# Altium schematic sheet ABC2.SchDoc
size D
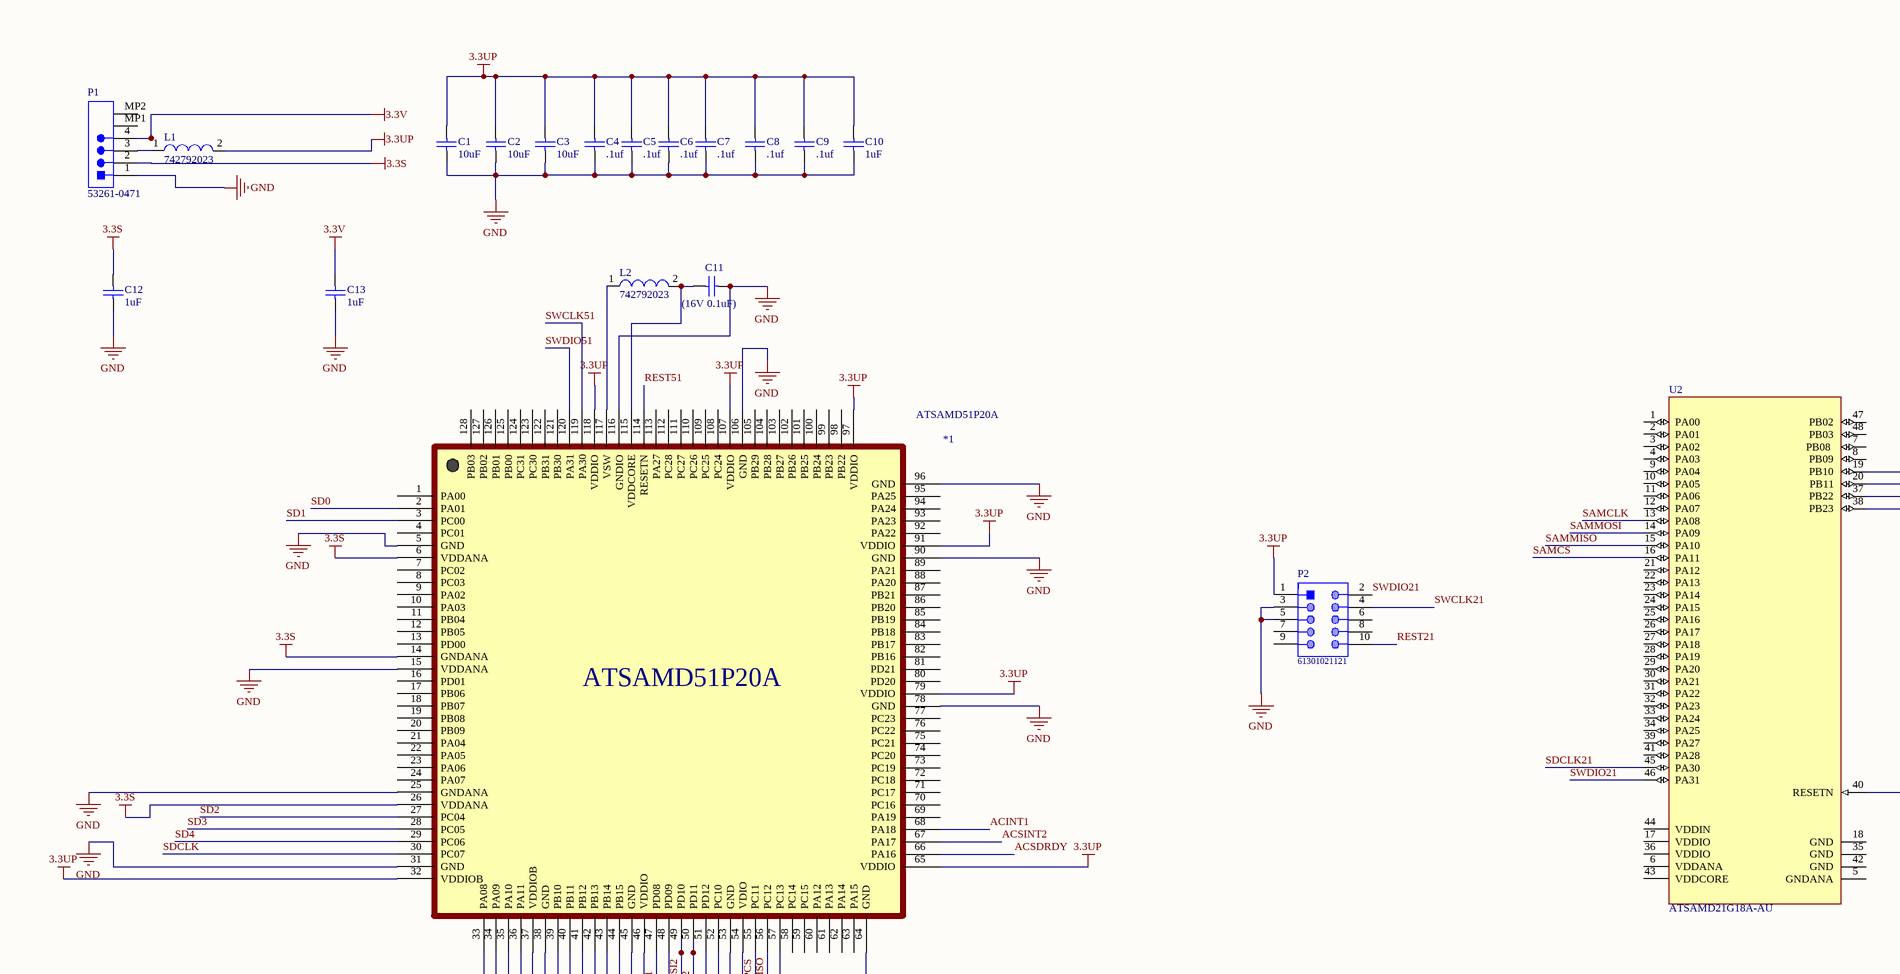
[diagram p0: ABC2.SchDoc, top left]
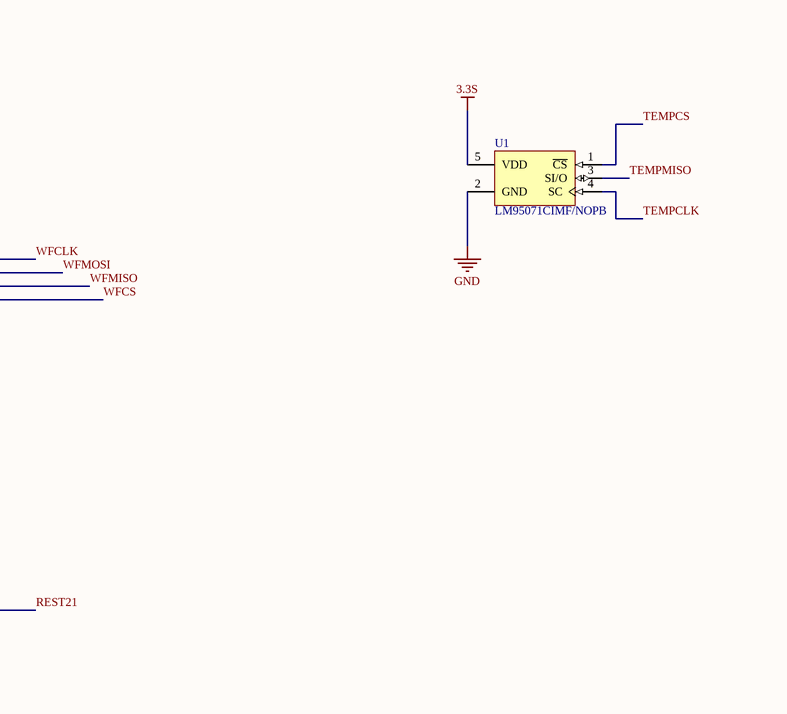
[diagram p1: ABC2.SchDoc, top right]
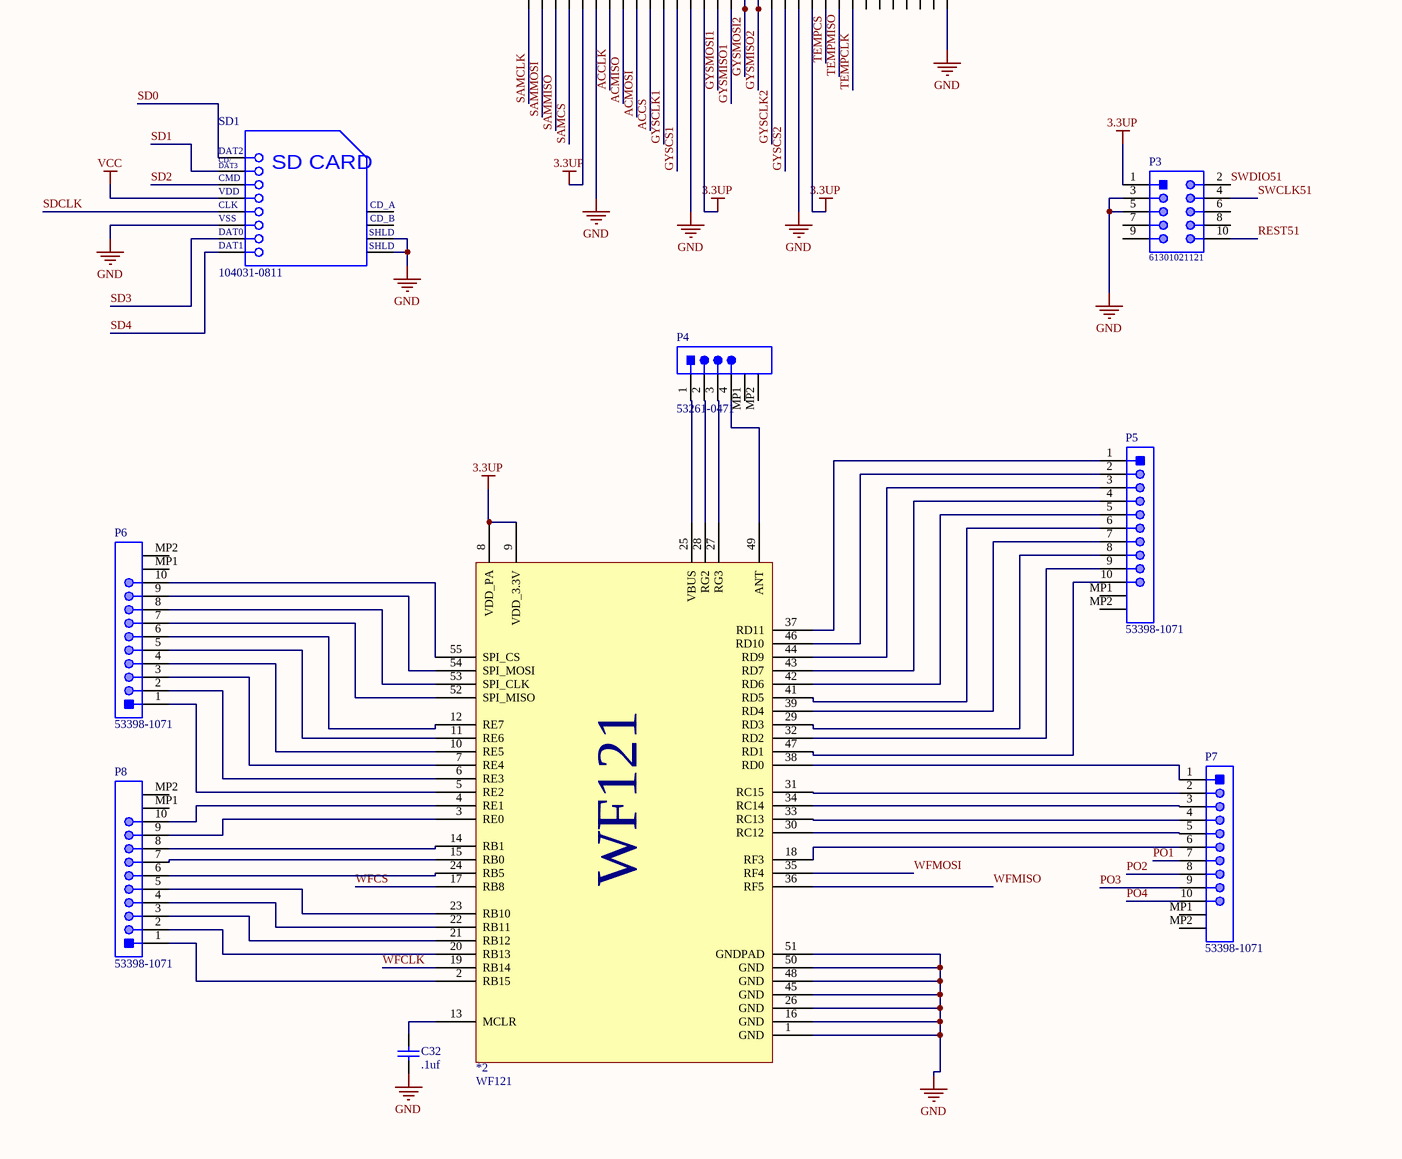
[diagram p2: ABC2.SchDoc, bottom left]
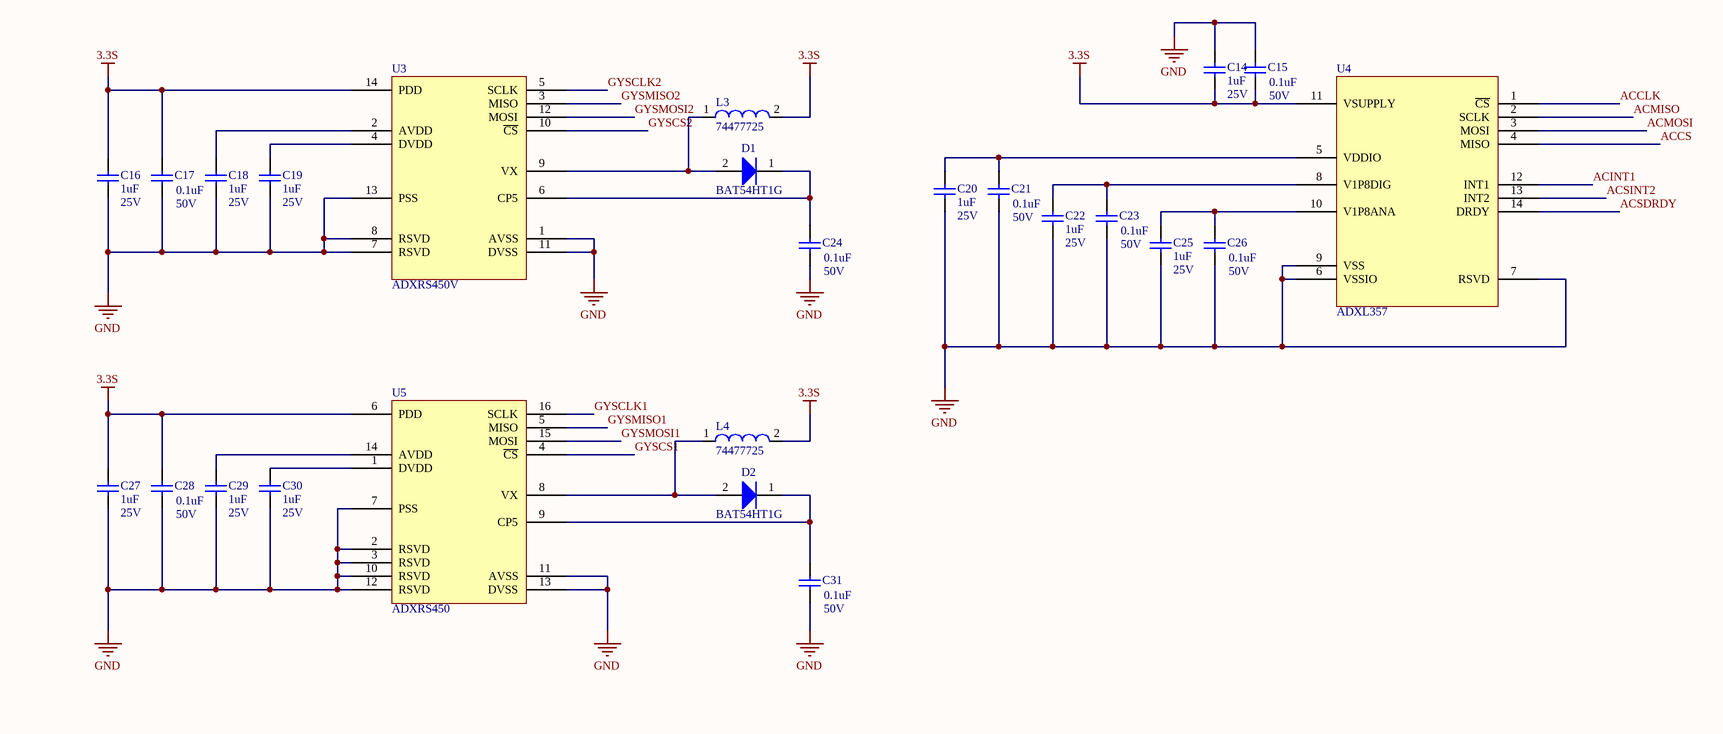
[diagram p3: ABC2.SchDoc, bottom right]

## Parts
*1  ATSAMD51P20A  [ATSAMD51P20A]
*2  WF121  [WF121]
C1  10uF  [CAPC1608X90X35NL10T15]
C2  10uF  [CAPC1608X90X35NL10T15]
C3  10uF  [CAPC1608X90X35NL10T15]
C4  .1uf  [CAPC2013X94X50NL20T25]
C5  .1uf  [CAPC2013X94X50NL20T25]
C6  .1uf  [CAPC2013X94X50NL20T25]
C7  .1uf  [CAPC2013X94X50NL20T25]
C8  .1uf  [CAPC2013X94X50NL20T25]
C9  .1uf  [CAPC2013X94X50NL20T25]
C10  1uF  [CAPC1608X90X35LL15T15]
C11  (16V 0.1uF)  [CAPC1608X90X35LL15T15]
C12  1uF  [CAPC1608X90X35LL15T15]
C13  1uF  [CAPC1608X90X35LL15T15]
C14  Capacitance: 1uF  Voltage Rating: 25V  [CAPC2013X140X50LL20T25]  (hidden comment: C0805C105K3RACTU)
C15  Voltage Rating: 50V  Capacitance: 0.1uF  [CAPC2013X95X50ML10T25]  (hidden comment: CC0805KRX7R9BB104)
C16  Capacitance: 1uF  Voltage Rating: 25V  [CAPC2013X140X50LL20T25]  (hidden comment: C0805C105K3RACTU)
C17  Voltage Rating: 50V  Capacitance: 0.1uF  [CAPC2013X95X50ML10T25]  (hidden comment: CC0805KRX7R9BB104)
C18  Capacitance: 1uF  Voltage Rating: 25V  [CAPC2013X140X50LL20T25]  (hidden comment: C0805C105K3RACTU)
C19  Capacitance: 1uF  Voltage Rating: 25V  [CAPC2013X140X50LL20T25]  (hidden comment: C0805C105K3RACTU)
C20  Capacitance: 1uF  Voltage Rating: 25V  [CAPC2013X140X50LL20T25]  (hidden comment: C0805C105K3RACTU)
C21  Voltage Rating: 50V  Capacitance: 0.1uF  [CAPC2013X95X50ML10T25]  (hidden comment: CC0805KRX7R9BB104)
C22  Capacitance: 1uF  Voltage Rating: 25V  [CAPC2013X140X50LL20T25]  (hidden comment: C0805C105K3RACTU)
C23  Voltage Rating: 50V  Capacitance: 0.1uF  [CAPC2013X95X50ML10T25]  (hidden comment: CC0805KRX7R9BB104)
C24  Voltage Rating: 50V  Capacitance: 0.1uF  [CAPC2013X95X50ML10T25]  (hidden comment: CC0805KRX7R9BB104)
C25  Capacitance: 1uF  Voltage Rating: 25V  [CAPC2013X140X50LL20T25]  (hidden comment: C0805C105K3RACTU)
C26  Voltage Rating: 50V  Capacitance: 0.1uF  [CAPC2013X95X50ML10T25]  (hidden comment: CC0805KRX7R9BB104)
C27  Capacitance: 1uF  Voltage Rating: 25V  [CAPC2013X140X50LL20T25]  (hidden comment: C0805C105K3RACTU)
C28  Voltage Rating: 50V  Capacitance: 0.1uF  [CAPC2013X95X50ML10T25]  (hidden comment: CC0805KRX7R9BB104)
C29  Capacitance: 1uF  Voltage Rating: 25V  [CAPC2013X140X50LL20T25]  (hidden comment: C0805C105K3RACTU)
C30  Capacitance: 1uF  Voltage Rating: 25V  [CAPC2013X140X50LL20T25]  (hidden comment: C0805C105K3RACTU)
C31  Voltage Rating: 50V  Capacitance: 0.1uF  [CAPC2013X95X50ML10T25]  (hidden comment: CC0805KRX7R9BB104)
C32  .1uf  [CAPC2013X94X50NL20T25]
D1  BAT54HT1G  [ONSC-SOD-323-2-477-02_V]
D2  BAT54HT1G  [ONSC-SOD-323-2-477-02_V]
L1  742792023  [SMD-0805]
L2  742792023  [SMD-0805]
L3  74477725  [WE-PD-M]
L4  74477725  [WE-PD-M]
P1  53261-0471  [MOLEX-53261-0471_V]
P2  61301021121  [61301021121]
P3  61301021121  [61301021121]
P4  53261-0471  [MOLEX-53261-0471_V]
P5  53398-1071  [MOLX-53398-1071_V]
P6  53398-1071  [MOLX-53398-1071_V]
P7  53398-1071  [MOLX-53398-1071_V]
P8  53398-1071  [MOLX-53398-1071_V]
SD1  104031-0811  [MOLX-104031-0811_V]
U1  LM95071CIMF/NOPB  [DBV0005A_L]
U2  ATSAMD21G18A-AU  [ATML-TQFP48_M]
U3  ADXRS450V  [LCC127P900X400X915-14N]
U4  ADXL357  [LCCS127P605X560X220-14N]
U5  ADXRS450  [SOIC127P1040X373-16N]

## Nets
3.3S: *1.6(VDDANA) *1.14(GNDANA) *1.26(VDDANA) C12.1 C14.2 C15.2 C16.1 C17.1 C27.1 C28.1 L3.2 L4.2 P1.2 U1.5(VDD) U3.14(PDD) U4.11(VSUPPLY) U5.6(PDD)
3.3UP: *1.32(VDDIOB) *1.37(VDDIOB) *1.46(VDDIO) *1.54(VDIO) *1.65(VDDIO) *1.79(VDDIO) *1.91(VDDIO) *1.97(VDDIO) *1.107(VDDIO) *1.118(VDDIO) *2.8(VDD_PA) *2.9(VDD_3.3V) C1.2 C2.2 C3.2 C4.2 C5.2 C6.2 C7.2 C8.2 C9.2 C10.2 L1.2 P2.1 P3.1
3.3V: C13.1 P1.4
GND: *1.5(GND) *1.15(VDDANA) *1.25(GNDANA) *1.31(GND) *1.38(GND) *1.45(GND) *1.53(GND) *1.64(GND) *1.78(GND) *1.90(GND) *1.96(GND) *1.106(GND) *1.116(GNDIO) *2.1(GND) *2.16(GND) *2.26(GND) *2.45(GND) *2.48(GND) *2.50(GND) *2.51(GNDPAD) C1.1 C2.1 C3.1 C4.1 C5.1 C6.1 C7.1 C8.1 C9.1 C10.1 C11.2 C12.2 C13.2 C14.1 C15.1 C16.2 C17.2 C18.2 C19.2 C20.2 C21.2 C22.2 C23.2 C24.2 C25.2 C26.2 C27.2 C28.2 C29.2 C30.2 C31.2 C32.1 P1.1 P2.3 P2.5 P3.3 P3.5 SD1.6(VSS2) SD1.11(SHLD1) SD1.12(SHLD2) U1.2(GND) U3.1(AVSS) U3.7(RSVD) U3.8(RSVD) U3.11(DVSS) U3.13(PSS) U4.6(VSSIO) U4.7(RSVD) U4.9(VSS) U5.2(RSVD) U5.3(RSVD) U5.7(PSS) U5.10(RSVD) U5.11(AVSS) U5.12(RSVD) U5.13(DVSS)
VCC: SD1.4(VDD)
ACCLK: *1.39(PB10) U4.1(~{CS})
ACCS: *1.42(PB13) U4.4(MISO)
ACINT1: *1.68(PA18) U4.12(INT1)
ACMISO: *1.40(PB11) U4.2(SCLK)
ACMOSI: *1.41(PB12) U4.3(MOSI)
ACSDRDY: *1.66(PA16) U4.14(DRDY)
ACSINT2: *1.67(PA17) U4.13(INT2)
GYSCLK1: *1.43(PB14) U5.16(SCLK)
GYSCLK2: *1.51(PD12) U3.5(SCLK)
GYSCS1: *1.44(PB15) U5.4(~{CS})
GYSCS2: *1.52(PC10) U3.10(~{CS})
GYSMISO1: *1.48(PD09) U5.5(MISO)
GYSMISO2: *1.50(PD11) U3.3(MISO)
GYSMOSI1: *1.47(PD08) U5.15(MOSI)
GYSMOSI2: *1.49(PD10) U3.12(MOSI)
PO1: P7.7
PO2: P7.8
PO3: P7.9
PO4: P7.10
REST21: P2.10 U2.40(RESETN)
REST51: *1.114(RESETN) P3.10
SAMCLK: *1.33(PA08) U2.13(PA08)
SAMCS: *1.36(PA11) U2.16(PA11)
SAMMISO: *1.35(PA10) U2.15(PA10)
SAMMOSI: *1.34(PA09) U2.14(PA09)
SD0: *1.2(PA01) SD1.1(CD/DAT3)
SD1: *1.3(PC00) SD1.2(CMD)
SD2: *1.27(PC04) SD1.3(VSS1)
SD3: *1.28(PC05) SD1.7(DAT0)
SD4: *1.29(PC06) SD1.8(DAT1)
SDCLK: *1.30(PC07) SD1.5(CLK)
SDCLK21: U2.45(PA30)
SWCLK21: P2.4
SWCLK51: *1.119(PA30) P3.4
SWDIO21: P2.2 U2.46(PA31)
SWDIO51: *1.120(PA31) P3.2
TEMPCLK: *1.57(PC13) U1.4(SC)
TEMPCS: *1.55(PC11) U1.1(~{CS})
TEMPMISO: *1.56(PC12) U1.3(SI/O)
WFCLK: *2.19(RB14) U2.19(PB10)
WFCS: *2.17(RB8) U2.38(PB23)
WFMISO: *2.36(RF5) U2.37(PB22)
WFMOSI: *2.35(RF4) U2.20(PB11)
Net*1_115: *1.115(VDDCORE) C11.1 L2.2
Net*1_117: *1.117(VSW) L2.1
Net*2_2: *2.2(RB15) P8.1
Net*2_3: *2.3(RE0) P8.9
Net*2_4: *2.4(RE1) P8.10
Net*2_5: *2.5(RE2) P6.1
Net*2_6: *2.6(RE3) P6.2
Net*2_7: *2.7(RE4) P6.3
Net*2_10: *2.10(RE5) P6.4
Net*2_11: *2.11(RE6) P6.5
Net*2_12: *2.12(RE7) P6.6
Net*2_13: *2.13(MCLR) C32.2
Net*2_14: *2.14(RB1) P8.8
Net*2_15: *2.15(RB0) P8.7
Net*2_18: *2.18(RF3) P7.6
Net*2_20: *2.20(RB13) P8.2
Net*2_21: *2.21(RB12) P8.3
Net*2_22: *2.22(RB11) P8.4
Net*2_23: *2.23(RB10) P8.5
Net*2_24: *2.24(RB5) P8.6
Net*2_25: *2.25(VBUS) P4.1
Net*2_27: *2.27(RG3) P4.3
Net*2_28: *2.28(RG2) P4.2
Net*2_29: *2.29(RD3) P5.8
Net*2_30: *2.30(RC12) P7.5
Net*2_31: *2.31(RC15) P7.2
Net*2_32: *2.32(RD2) P5.9
Net*2_33: *2.33(RC13) P7.4
Net*2_34: *2.34(RC14) P7.3
Net*2_37: *2.37(RD11) P5.1
Net*2_38: *2.38(RD0) P7.1
Net*2_39: *2.39(RD4) P5.7
Net*2_41: *2.41(RD5) P5.6
Net*2_42: *2.42(RD6) P5.5
Net*2_43: *2.43(RD7) P5.4
Net*2_44: *2.44(RD9) P5.3
Net*2_46: *2.46(RD10) P5.2
Net*2_47: *2.47(RD1) P5.10
Net*2_49: *2.49(ANT) P4.4
Net*2_52: *2.52(SPI_MISO) P6.7
Net*2_53: *2.53(SPI_CLK) P6.8
Net*2_54: *2.54(SPI_MOSI) P6.9
Net*2_55: *2.55(SPI_CS) P6.10
NetC18_1: C18.1 U3.2(AVDD)
NetC19_1: C19.1 U3.4(DVDD)
NetC20_1: C20.1 C21.1 U4.5(VDDIO)
NetC22_1: C22.1 C23.1 U4.8(V1P8DIG)
NetC24_1: C24.1 D1.1(K) U3.6(CP5)
NetC25_1: C25.1 C26.1 U4.10(V1P8ANA)
NetC29_1: C29.1 U5.14(AVDD)
NetC30_1: C30.1 U5.1(DVDD)
NetC31_1: C31.1 D2.1(K) U5.9(CP5)
NetD1_2: D1.2(A) L3.1 U3.9(VX)
NetD2_2: D2.2(A) L4.1 U5.8(VX)
NetL1_1: L1.1 P1.3

Not connected (* = marked no-connect by the designer): *1 1(PA00) 4(PC01) 7(PC02) 8(PC03) 9(PA02) 10(PA03) 11(PB04) 12(PB05) 13(PD00) 16(PD01) 17(PB06) 18(PB07) 19(PB08) 20(PB09) 21(PA04) 22(PA05) 23(PA06) 24(PA07) 58(PC14) 59(PC15) 60(PA12) 61(PA13) 62(PA14) 63(PA15) 69(PA19) 70(PC16) 71(PC17) 72(PC18) 73(PC19) 74(PC20) 75(PC21) 76(PC22) 77(PC23) 80(PD20) 81(PD21) 82(PB16) 83(PB17) 84(PB18) 85(PB19) 86(PB20) 87(PB21) 88(PA20) 89(PA21) 92(PA22) 93(PA23) 94(PA24) 95(PA25) 98(PB22) 99(PB23) 100(PB24) 101(PB25) 102(PB26) 103(PB27) 104(PB28) 105(PB29) 108(PC24) 109(PC25) 110(PC26) 111(PC27) 112(PC28) 113(PA27) 121(PB30) 122(PB31) 123(PC30) 124(PC31) 125(PB00) 126(PB01) 127(PB02) 128(PB03); P1 MP1 MP2; P2 6 7 8 9; P3 6 7 8 9; P4 MP1 MP2; P5 MP1 MP2; P6 MP1 MP2; P7 MP1 MP2; P8 MP1 MP2; SD1 9(CD_A) 10(CD_B); U2 1(PA00) 2(PA01) 3(PA02) 4(PA03) 5(GNDANA) 6(VDDANA) 7(PB08_) 8(PB09) 9(PA04) 10(PA05) 11(PA06) 12(PA07) 17(VDDIO) 18(GND) 21(PA12) 22(PA13_) 23(PA14_) 24(PA15) 25(PA16) 26(PA17) 27(PA18) 28(PA19) 29(PA20) 30(PA21) 31(PA22) 32(PA23_) 33(PA24) 34(PA25) 35(GND) 36(VDDIO) 39(PA27) 41(PA28_) 42(GND) 43(VDDCORE) 44(VDDIN) 47(PB02) 48(PB03)

## Notes on the sheet
- (in symbol CMP-2000-05825-1) DAT2; CD/; DAT3; SD CARD; VSS; SHLD

## Library data of the parts
*1 = ATSAMD51P20A: https://www.microchip.com/wwwproducts/en/ATSAMD51P20A#additional-features; ComponentLink1Description: ATSAMD51P20A; ComponentLink1URL: https://www.microchip.com/wwwproducts/en/ATSAMD51P20A#additional-features
*2 = WF121: WF121 WIFI Module.; ComponentLink1Description: Datasheet; ComponentLink1URL: https://www.silabs.com/documents/public/data-sheets/WF121-DataSheet.pdf
C1-C3 = CMP-2006-02792-1: Part Number: GRM188R60J106ME47D; Manufacturer: Murata
C4-C9 C32 = CMP-2007-04454-1: Part Number: 0805YC104KAT2A; Manufacturer: AVX Interconnect / Elco
C10 C12 C13 = CMP-2006-04551-1: Part Number: 0603ZC105KAT2A; Manufacturer: AVX Interconnect / Elco
C11 = CMP-2006-02126-1: Part Number: 0603YC104MAT4A; Manufacturer: AVX Interconnect / Elco
C14 C16 C18-C20 C22 C25 C27 C29 C30 = CMP-2007-03234-1: Manufacturer: Kemet; Part Number: C0805C105K3RACTU
C15 C17 C21 C23 C24 C26 C28 C31 = CMP-2100-03606-1: Chip Capacitor, 100 nF, +/- 10%, 50 V, -55 to 125 degC, 0805 (2012 Metric), RoHS, Tape and Reel; Manufacturer: Yageo; Dielectric: X7R; Insulation Resistance: 100GR; Material: Ceramic; Tolerance: 10%; RoHSCompliant: True; Case Code (Metric): 2012; Length: 2mm; Lead Free: LeadFree; Radiation Hardening: No; Min Operating Temperature: -55degC; Max Operating Temperature: 125degC; Voltage: 50V; Termination: SMD/SMT; Thickness: 0.033inch; Package Description: 2-Pin Surface Mount Device, Body 2 x 1.25 mm; Depth: 1.25mm; Packaging: TapeandReel; Datasheet Version: Rev. 15, 10/2016; Height: 0.85mm; Package Reference: 0805; Manufacturer URL: http://www.yageo.com/; Case/Package: 0805; Case Code (Imperial): 0805; Datasheet URL: http://www.yageo.com/documents/recent/UPY-GPHC_X7R_6.3V-to-50V_15.pdf; Mount: SurfaceMount; REACH SVHC: NoSVHC; Package Quantity: 1; Number of Pins: 2; Width: 0.049inch
D1 D2 = CMP-1055-00462-1: Schottky Barrier Diode, 2-Pin SOD-323, Pb-Free, Tape and Reel; Manufacturer: On Semiconductor; Configuration: Single; trr Max (ns): 5; IFSM Max (A): 0.6; ComponentLink3URL: http://www.onsemi.com/pub_link/Collateral/477-02.PDF.1; PackageDescription: 2-Pin SOD, Body 1.7 x 1.25 mm; ComponentLink2URL: http://www.onsemi.cn/pub_link/Collateral/BAT54HT1-D.PDF; ComponentLink3Description: Package Specification; ComponentLink2Description: Datasheet; DatasheetVersion: Rev. 6; PackageReference: SOD-323-2-477-02; RoHS: TRUE; ComponentLink1URL: http://www.onsemi.com/; Packing: Tape and Reel; PartNumber: BAT54HT1G; Mounting Technology: Surface Mount; ComponentLink1Description: Manufacturer URL; PackageVersion: Rev. H, 03/2007
L1 L2 = CMP-0220-00030-1: SMD EMI Suppression Ferrite Bead WE-CBF, Z = 120 Ohm; Impedance: 120 Ohm; PackageDescription: Chip Inductor, 2-Leads, Body 2.0 x 1.2 mm; ComponentLink2URL: http://www.we-online.de/katalog/media/pdf/742792023.pdf; ComponentLink1Description: Manufacturer Link; ComponentLink2Description: Datasheet; DatasheetVersion: Dec-2005; PackageReference: SMD-0805; ComponentLink1URL: http://www.we-online.com; PackageVersion: 2005
L3 L4 = CMP-0227-00119-1: SMD-Shielded Power Inductor WE-PD, L = 560 µH; Inductance: 560 ÂµH; ComponentLink1Description: Manufacturer Link; PackageReference: WE-PD-M; PackageVersion: 2006; ComponentLink2URL: http://www.we-online.de/katalog/media/pdf/74477725.pdf; PackageDescription: SMD Inductor, 2-Leads, Body 7.3 x 7.3 mm; ComponentLink2Description: Datasheet; ComponentLink1URL: http://www.we-online.com; DatasheetVersion: ver 2, Oct-2004
P1 P4 = CMP-2000-05238-1: Male Header, Pitch 1.25 mm, 1 x 4 Position, Height 3.4 mm, -40 to 85 degC, RoHS, Tape and Reel; Current Rating: 1A; Brand: Molex; Number of Positions / Contacts: 4; Pitch: 1.25mm; Voltage Rating: 125V; Mounting Angle: Right; Manufacturer URL: http://www.molex.com/; Factory Pack Quantity: 1000; Housing Material: Thermoplastic; Datasheet URL: http://www.molex.com/pdm_docs/sd/532610471_sd.pdf; Tradename: PicoBlade; Product Type: Headers; Contact Plating: Tin; Contact Material: PhosphorBronze; Package Description: 1.25mm Pitch PicoBlade(TM) Header, Surface Mount, Right Angle, Lead-Free, 4 Circuits; Mounting Style: SMD/SMT; Manufacturer: Molex; Series: 53261; Packaging: Reel; Number of Rows: 1; RoHS: Details; Number of Positions: 4; Product Category: Headers&WireHousings; Datasheet Version: Rev. G, 01/2012; Type: Shrouded; Termination Style: SMD
P2 P3 = CMP-1502-01084-1: THT Vertical Pin Header WR-PHD, Pitch 2.54 mm, Dual Row, 10 pins; Manufacturer: Wurth Elektronik; Working Voltage: 250VAC; Pitch: 2.54mm; Contact Resistance: 20mOhm; Gender: Male; Rated Current: 3A; Withstanding Voltage: 500VAC; Pin Number: 10; Operating Temperature: -40to105degC; Mounting Technology: THT; Publisher: WurthElektronik; Manufacturer URL: http://www.we-online.de; Part Number: 61301021121; Row Number: Dual; Packaging: Bag; Orientation: Vertical; Package Reference: 61301021121; Datasheet URL: https://katalog.we-online.de/em/datasheet/6130xx21121.pdf
P5-P8 = CMP-2000-05635-1: Male Header, Pitch 1.25 mm, 1 x 10 Position, Height 4.7 mm, -40 to 85 degC, RoHS, Tape and Reel; Manufacturer: Molex; Mounting Angle: Vertical; Pitch: 1.25mm; Voltage Rating: 125V; Current Rating: 1A; Number of Rows: 1Row; Housing Material: Nylon; Mounting Technology: SurfaceMount; Mounting Style: SMD; Contact Material: PhosphorBronze; Product: Headers; Datasheet URL: http://www.molex.com/pdm_docs/sd/533981071_sd.pdf; Manufacturer URL: http://www.molex.com/; Datasheet Version: Rev. J, 09/2015; Factory Pack Quantity: 1000; Brand: Molex; Packaging: Reel; Product Category: Headers&WireHousings; Contact Gender: Pin(Male); Number of Positions: 10Position; RoHS: Details; Contact Plating: Tin; Package Description: Male Header, Pitch 1.25 mm, 1 x 10 Position, Height 4.7 mm; Series: 53398; Type: Shrouded; Package Reference: 53398-1071; Tradename: PicoBlade; Termination Style: SMD
SD1 = CMP-2000-05825-1: Micro SD Card, RA, -25 to 85 degC, 8-Pin SMD, RoHS, Tape and Reel; Voltage Rating: 10VAC/DC; Number of Contacts: 8; Insertion - Extraction Style: Push-Pull; Pitch: 1.1mm; Mating Cycles: 10000; Brand: Molex; Current Rating: 500mA; Manufacturer URL: http://www.molex.com/; Card Type: microSD; Mounting Type: Standard; Height: 1.42mm; Mounting Technology: SurfaceMount; Contact Plating: Gold; Product Category: MemoryCardConnectors; Package Description: 8-Pin Surface Mount Device, Body 11.95 x 11.4 mm, Pitch 1.1 mm; Datasheet URL: http://www.molex.com/pdm_docs/sd/1040310811_sd.pdf; Termination Style: SMD; Length: 11.4mm; Housing Material: LiquidCrystalPolymer(LCP); Orientation: RightAngle; RoHS: True; Contact Material: PhosphorBronze; Datasheet Version: Rev. E, 04/2006; Packaging: Reel; Manufacturer: Molex; Series: 104031; Product: CardConnectors; Number of Rows: 1Row; Package Reference: 104031-0811
U1 = CMP-0066-00211-3: SPI/MICROWIRE 13-Bit Plus Sign Temperature Sensor, 5-pin SOT-23, Pb-Free; Manufacturer: Texas Instruments; CompType: Temp Sensor IC; PackageTopMarking: T18C*XTT; PowerWise: Y; PackageDescription: Molded SOT-23, .115 x .063 x .040 in Body, 5 Lead, .0375 in Pitch; ComponentLink1URL: http://www.ti.com/general/docs/lit/getliterature.tsp?genericPartNumber=LM95071&fileType=pdf; ComponentLink1Description: Datasheet URL; PinCount: 5; RoHS: Y; PackageReference: DBV0005A
U2 = CMP-2100-03585-1: SMART ARM-Based Microcontroller, 1.62 to 3.63 V, 256 KB Flash, 32 KB SRAM, -40 to 85 degC, 48-Pin TQFP, RoHS, Tray; Manufacturer: Atmel; Max Frequency: 48MHz; Number of Timers/Counters: 6; Max Supply Voltage: 3.63V; Min Supply Voltage: 1.62V; Packaging: Tray; Datasheet Version: Rev. N, 10/2016; Datasheet URL: http://www.atmel.com/images/atmel-42181-sam-d21_datasheet.pdf; REACH SVHC: NoSVHC; RoHSCompliant: true; Max Operating Temperature: 85degC; Manufacturer URL: http://www.atmel.com/; Contact Plating: Tin; Frequency: 48MHz; Package Description: 48-Pin Thin Profile Plastic Quad Flat Package, Body 7 x 7 mm, Pitch 0.5 mm; Package Reference: TQFP48; Lead Free: LeadFree; Number of Pins: 48; Min Operating Temperature: -40degC; Case/Package: TQFP; Mount: SurfaceMount